# Altium schematic sheet hef4051bt.schdoc
size 53 x 47 mm
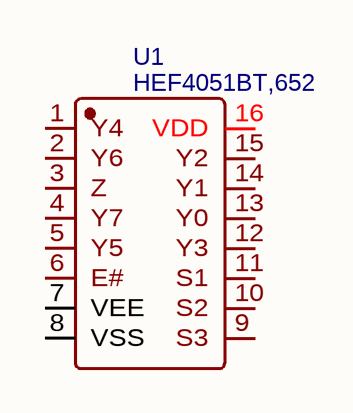
[diagram p0: hef4051bt.schdoc]

## Parts
U1  HEF4051BT,652  [SO-16_L10.0-W4.0-P1.27-LS6.2-BL]

## Nets

Not connected (* = marked no-connect by the designer): U1 1(Y4) 2(Y6) 3(Z) 4(Y7) 5(Y5) 6(E#) 7(VEE) 8(VSS) 9(S3) 10(S2) 11(S1) 12(Y3) 13(Y0) 14(Y1) 15(Y2) 16(VDD)

## Library data of the parts
U1 = HEF4051BT,652: BOM_Manufacturer: Nexperia; Contributor: LCSC; BOM_Supplier: LCSC; BOM_Supplier Part: C545797; BOM_Manufacturer Part: HEF4051BT,652; spicePre: U; spiceSymbolName: HEF4051BT,652